# Altium schematic sheet TD4-ROM.SchDoc
size A2
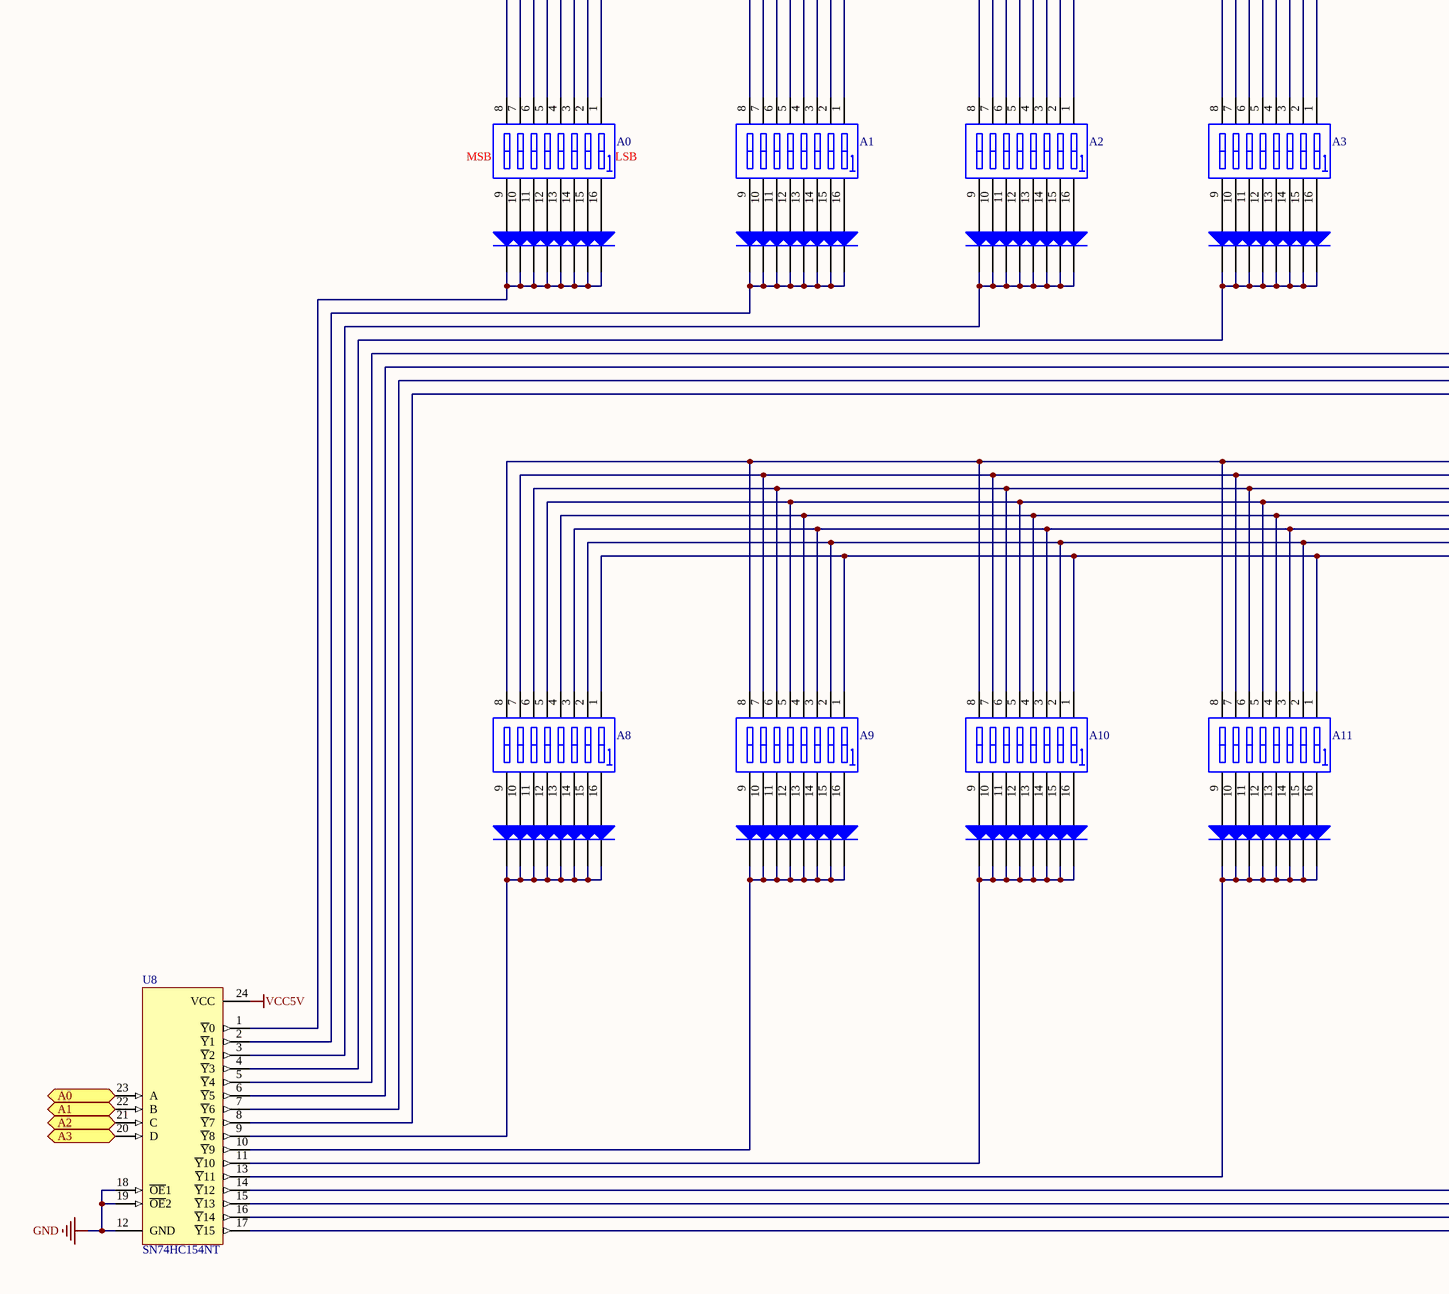
[diagram p0: TD4-ROM.SchDoc, left]
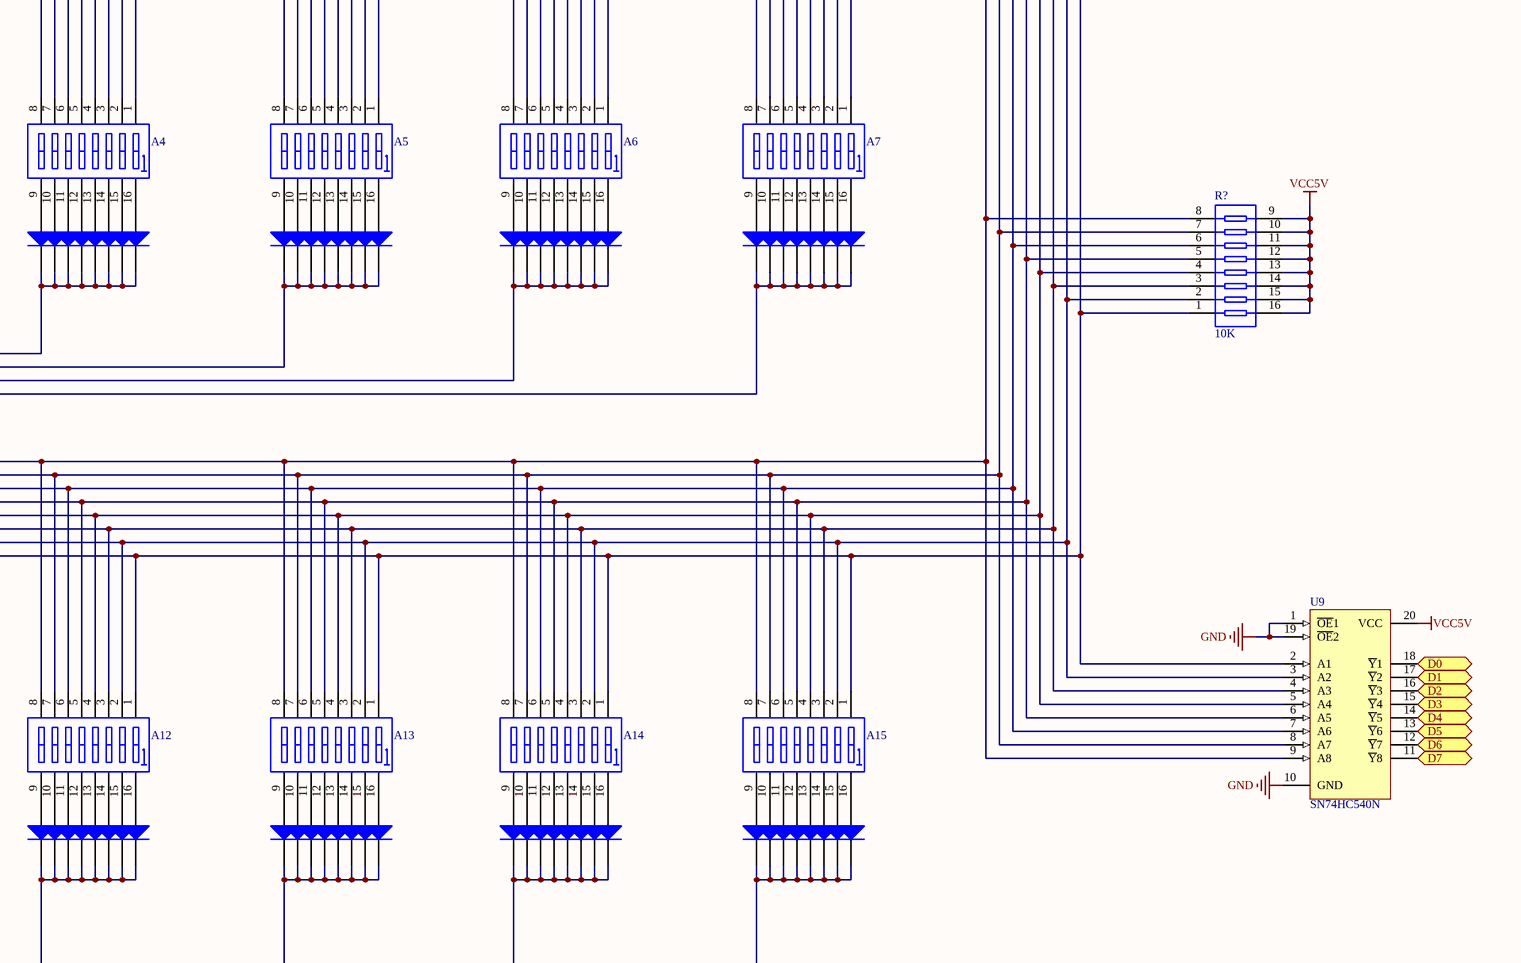
[diagram p1: TD4-ROM.SchDoc, right]

## Parts
D1  Diode 1N4148  [DO-35]  (value not drawn)
D2  Diode 1N4148  [DO-35]  (value not drawn)
D3  Diode 1N4148  [DO-35]  (value not drawn)
D4  Diode 1N4148  [DO-35]  (value not drawn)
D5  Diode 1N4148  [DO-35]  (value not drawn)
D6  Diode 1N4148  [DO-35]  (value not drawn)
D7  Diode 1N4148  [DO-35]  (value not drawn)
D8  Diode 1N4148  [DO-35]  (value not drawn)
D9  Diode 1N4148  [DO-35]  (value not drawn)
D10  Diode 1N4148  [DO-35]  (value not drawn)
D11  Diode 1N4148  [DO-35]  (value not drawn)
D12  Diode 1N4148  [DO-35]  (value not drawn)
D13  Diode 1N4148  [DO-35]  (value not drawn)
D14  Diode 1N4148  [DO-35]  (value not drawn)
D15  Diode 1N4148  [DO-35]  (value not drawn)
D16  Diode 1N4148  [DO-35]  (value not drawn)
D17  Diode 1N4148  [DO-35]  (value not drawn)
D18  Diode 1N4148  [DO-35]  (value not drawn)
D19  Diode 1N4148  [DO-35]  (value not drawn)
D20  Diode 1N4148  [DO-35]  (value not drawn)
D21  Diode 1N4148  [DO-35]  (value not drawn)
D22  Diode 1N4148  [DO-35]  (value not drawn)
D23  Diode 1N4148  [DO-35]  (value not drawn)
D24  Diode 1N4148  [DO-35]  (value not drawn)
D25  Diode 1N4148  [DO-35]  (value not drawn)
D26  Diode 1N4148  [DO-35]  (value not drawn)
D27  Diode 1N4148  [DO-35]  (value not drawn)
D28  Diode 1N4148  [DO-35]  (value not drawn)
D29  Diode 1N4148  [DO-35]  (value not drawn)
D30  Diode 1N4148  [DO-35]  (value not drawn)
D31  Diode 1N4148  [DO-35]  (value not drawn)
D32  Diode 1N4148  [DO-35]  (value not drawn)
D33  Diode 1N4148  [DO-35]  (value not drawn)
D34  Diode 1N4148  [DO-35]  (value not drawn)
D35  Diode 1N4148  [DO-35]  (value not drawn)
D36  Diode 1N4148  [DO-35]  (value not drawn)
D37  Diode 1N4148  [DO-35]  (value not drawn)
D38  Diode 1N4148  [DO-35]  (value not drawn)
D39  Diode 1N4148  [DO-35]  (value not drawn)
D40  Diode 1N4148  [DO-35]  (value not drawn)
D41  Diode 1N4148  [DO-35]  (value not drawn)
D42  Diode 1N4148  [DO-35]  (value not drawn)
D43  Diode 1N4148  [DO-35]  (value not drawn)
D44  Diode 1N4148  [DO-35]  (value not drawn)
D45  Diode 1N4148  [DO-35]  (value not drawn)
D46  Diode 1N4148  [DO-35]  (value not drawn)
D47  Diode 1N4148  [DO-35]  (value not drawn)
D48  Diode 1N4148  [DO-35]  (value not drawn)
D49  Diode 1N4148  [DO-35]  (value not drawn)
D50  Diode 1N4148  [DO-35]  (value not drawn)
D51  Diode 1N4148  [DO-35]  (value not drawn)
D52  Diode 1N4148  [DO-35]  (value not drawn)
D53  Diode 1N4148  [DO-35]  (value not drawn)
D54  Diode 1N4148  [DO-35]  (value not drawn)
D55  Diode 1N4148  [DO-35]  (value not drawn)
D56  Diode 1N4148  [DO-35]  (value not drawn)
D57  Diode 1N4148  [DO-35]  (value not drawn)
D58  Diode 1N4148  [DO-35]  (value not drawn)
D59  Diode 1N4148  [DO-35]  (value not drawn)
D60  Diode 1N4148  [DO-35]  (value not drawn)
D61  Diode 1N4148  [DO-35]  (value not drawn)
D62  Diode 1N4148  [DO-35]  (value not drawn)
D63  Diode 1N4148  [DO-35]  (value not drawn)
D64  Diode 1N4148  [DO-35]  (value not drawn)
D65  Diode 1N4148  [DO-35]  (value not drawn)
D66  Diode 1N4148  [DO-35]  (value not drawn)
D67  Diode 1N4148  [DO-35]  (value not drawn)
D68  Diode 1N4148  [DO-35]  (value not drawn)
D69  Diode 1N4148  [DO-35]  (value not drawn)
D70  Diode 1N4148  [DO-35]  (value not drawn)
D71  Diode 1N4148  [DO-35]  (value not drawn)
D72  Diode 1N4148  [DO-35]  (value not drawn)
D73  Diode 1N4148  [DO-35]  (value not drawn)
D74  Diode 1N4148  [DO-35]  (value not drawn)
D75  Diode 1N4148  [DO-35]  (value not drawn)
D76  Diode 1N4148  [DO-35]  (value not drawn)
D77  Diode 1N4148  [DO-35]  (value not drawn)
D78  Diode 1N4148  [DO-35]  (value not drawn)
D79  Diode 1N4148  [DO-35]  (value not drawn)
D80  Diode 1N4148  [DO-35]  (value not drawn)
D81  Diode 1N4148  [DO-35]  (value not drawn)
D82  Diode 1N4148  [DO-35]  (value not drawn)
D83  Diode 1N4148  [DO-35]  (value not drawn)
D84  Diode 1N4148  [DO-35]  (value not drawn)
D85  Diode 1N4148  [DO-35]  (value not drawn)
D86  Diode 1N4148  [DO-35]  (value not drawn)
D87  Diode 1N4148  [DO-35]  (value not drawn)
D88  Diode 1N4148  [DO-35]  (value not drawn)
D89  Diode 1N4148  [DO-35]  (value not drawn)
D90  Diode 1N4148  [DO-35]  (value not drawn)
D91  Diode 1N4148  [DO-35]  (value not drawn)
D92  Diode 1N4148  [DO-35]  (value not drawn)
D93  Diode 1N4148  [DO-35]  (value not drawn)
D94  Diode 1N4148  [DO-35]  (value not drawn)
D95  Diode 1N4148  [DO-35]  (value not drawn)
D96  Diode 1N4148  [DO-35]  (value not drawn)
D97  Diode 1N4148  [DO-35]  (value not drawn)
D98  Diode 1N4148  [DO-35]  (value not drawn)
D99  Diode 1N4148  [DO-35]  (value not drawn)
D100  Diode 1N4148  [DO-35]  (value not drawn)
D101  Diode 1N4148  [DO-35]  (value not drawn)
D102  Diode 1N4148  [DO-35]  (value not drawn)
D103  Diode 1N4148  [DO-35]  (value not drawn)
D104  Diode 1N4148  [DO-35]  (value not drawn)
D105  Diode 1N4148  [DO-35]  (value not drawn)
D106  Diode 1N4148  [DO-35]  (value not drawn)
D107  Diode 1N4148  [DO-35]  (value not drawn)
D108  Diode 1N4148  [DO-35]  (value not drawn)
D109  Diode 1N4148  [DO-35]  (value not drawn)
D110  Diode 1N4148  [DO-35]  (value not drawn)
D111  Diode 1N4148  [DO-35]  (value not drawn)
D112  Diode 1N4148  [DO-35]  (value not drawn)
D113  Diode 1N4148  [DO-35]  (value not drawn)
D114  Diode 1N4148  [DO-35]  (value not drawn)
D115  Diode 1N4148  [DO-35]  (value not drawn)
D116  Diode 1N4148  [DO-35]  (value not drawn)
D117  Diode 1N4148  [DO-35]  (value not drawn)
D118  Diode 1N4148  [DO-35]  (value not drawn)
D119  Diode 1N4148  [DO-35]  (value not drawn)
D120  Diode 1N4148  [DO-35]  (value not drawn)
D121  Diode 1N4148  [DO-35]  (value not drawn)
D122  Diode 1N4148  [DO-35]  (value not drawn)
D123  Diode 1N4148  [DO-35]  (value not drawn)
D124  Diode 1N4148  [DO-35]  (value not drawn)
D125  Diode 1N4148  [DO-35]  (value not drawn)
D126  Diode 1N4148  [DO-35]  (value not drawn)
D127  Diode 1N4148  [DO-35]  (value not drawn)
D128  Diode 1N4148  [DO-35]  (value not drawn)
R?  value 10K  [SSOP16_N]  (hidden comment: Res Pack4)
S1  A0  [DIP_SW_8WAY_SMD]
S2  A1  [DIP_SW_8WAY_SMD]
S3  A2  [DIP_SW_8WAY_SMD]
S4  A3  [DIP_SW_8WAY_SMD]
S5  A4  [DIP_SW_8WAY_SMD]
S6  A5  [DIP_SW_8WAY_SMD]
S7  A6  [DIP_SW_8WAY_SMD]
S8  A7  [DIP_SW_8WAY_SMD]
S9  A8  [DIP_SW_8WAY_SMD]
S10  A9  [DIP_SW_8WAY_SMD]
S11  A10  [DIP_SW_8WAY_SMD]
S12  A11  [DIP_SW_8WAY_SMD]
S13  A12  [DIP_SW_8WAY_SMD]
S14  A13  [DIP_SW_8WAY_SMD]
S15  A14  [DIP_SW_8WAY_SMD]
S16  A15  [DIP_SW_8WAY_SMD]
U8  SN74HC154NT  [NT024D]
U9  SN74HC540N  [N020]

## Ports
A0, A1, A2, A3, D0, D1, D2, D3, D4, D5, D6, D7

## Nets
GND: U8.12(GND) U8.18(~{OE}1) U8.19(~{OE}2) U9.1(~{OE}1) U9.10(GND) U9.19(~{OE}2)
VCC5V: R?.9 R?.10 R?.11 R?.12 R?.13 R?.14 R?.15 R?.16 U8.24(VCC) U9.20(VCC)
A0: U8.23(A) ; port A0
A1: U8.22(B) ; port A1
A2: U8.21(C) ; port A2
A3: U8.20(D) ; port A3
D0: U9.18(~{Y}1) ; port D0
D1: U9.17(~{Y}2) ; port D1
D2: U9.16(~{Y}3) ; port D2
D3: U9.15(~{Y}4) ; port D3
D4: U9.14(~{Y}5) ; port D4
D5: U9.13(~{Y}6) ; port D5
D6: U9.12(~{Y}7) ; port D6
D7: U9.11(~{Y}8) ; port D7
NetD1_1: D1.1(A) S1.9(B8)
NetD1_2: D1.2(K) D2.2(K) D3.2(K) D4.2(K) D5.2(K) D6.2(K) D7.2(K) D8.2(K) U8.1(~{Y}0)
NetD2_1: D2.1(A) S1.10(B7)
NetD3_1: D3.1(A) S1.11(B6)
NetD4_1: D4.1(A) S1.12(B5)
NetD5_1: D5.1(A) S1.13(B4)
NetD6_1: D6.1(A) S1.14(B3)
NetD7_1: D7.1(A) S1.15(B2)
NetD8_1: D8.1(A) S1.16(B1)
NetD9_1: D9.1(A) S2.9(B8)
NetD9_2: D9.2(K) D10.2(K) D11.2(K) D12.2(K) D13.2(K) D14.2(K) D15.2(K) D16.2(K) U8.2(~{Y}1)
NetD10_1: D10.1(A) S2.10(B7)
NetD11_1: D11.1(A) S2.11(B6)
NetD12_1: D12.1(A) S2.12(B5)
NetD13_1: D13.1(A) S2.13(B4)
NetD14_1: D14.1(A) S2.14(B3)
NetD15_1: D15.1(A) S2.15(B2)
NetD16_1: D16.1(A) S2.16(B1)
NetD17_1: D17.1(A) S3.9(B8)
NetD17_2: D17.2(K) D18.2(K) D19.2(K) D20.2(K) D21.2(K) D22.2(K) D23.2(K) D24.2(K) U8.3(~{Y}2)
NetD18_1: D18.1(A) S3.10(B7)
NetD19_1: D19.1(A) S3.11(B6)
NetD20_1: D20.1(A) S3.12(B5)
NetD21_1: D21.1(A) S3.13(B4)
NetD22_1: D22.1(A) S3.14(B3)
NetD23_1: D23.1(A) S3.15(B2)
NetD24_1: D24.1(A) S3.16(B1)
NetD25_1: D25.1(A) S4.9(B8)
NetD25_2: D25.2(K) D26.2(K) D27.2(K) D28.2(K) D29.2(K) D30.2(K) D31.2(K) D32.2(K) U8.4(~{Y}3)
NetD26_1: D26.1(A) S4.10(B7)
NetD27_1: D27.1(A) S4.11(B6)
NetD28_1: D28.1(A) S4.12(B5)
NetD29_1: D29.1(A) S4.13(B4)
NetD30_1: D30.1(A) S4.14(B3)
NetD31_1: D31.1(A) S4.15(B2)
NetD32_1: D32.1(A) S4.16(B1)
NetD33_1: D33.1(A) S5.9(B8)
NetD33_2: D33.2(K) D34.2(K) D35.2(K) D36.2(K) D37.2(K) D38.2(K) D39.2(K) D40.2(K) U8.5(~{Y}4)
NetD34_1: D34.1(A) S5.10(B7)
NetD35_1: D35.1(A) S5.11(B6)
NetD36_1: D36.1(A) S5.12(B5)
NetD37_1: D37.1(A) S5.13(B4)
NetD38_1: D38.1(A) S5.14(B3)
NetD39_1: D39.1(A) S5.15(B2)
NetD40_1: D40.1(A) S5.16(B1)
NetD41_1: D41.1(A) S6.9(B8)
NetD41_2: D41.2(K) D42.2(K) D43.2(K) D44.2(K) D45.2(K) D46.2(K) D47.2(K) D48.2(K) U8.6(~{Y}5)
NetD42_1: D42.1(A) S6.10(B7)
NetD43_1: D43.1(A) S6.11(B6)
NetD44_1: D44.1(A) S6.12(B5)
NetD45_1: D45.1(A) S6.13(B4)
NetD46_1: D46.1(A) S6.14(B3)
NetD47_1: D47.1(A) S6.15(B2)
NetD48_1: D48.1(A) S6.16(B1)
NetD49_1: D49.1(A) S7.9(B8)
NetD49_2: D49.2(K) D50.2(K) D51.2(K) D52.2(K) D53.2(K) D54.2(K) D55.2(K) D56.2(K) U8.7(~{Y}6)
NetD50_1: D50.1(A) S7.10(B7)
NetD51_1: D51.1(A) S7.11(B6)
NetD52_1: D52.1(A) S7.12(B5)
NetD53_1: D53.1(A) S7.13(B4)
NetD54_1: D54.1(A) S7.14(B3)
NetD55_1: D55.1(A) S7.15(B2)
NetD56_1: D56.1(A) S7.16(B1)
NetD57_1: D57.1(A) S8.9(B8)
NetD57_2: D57.2(K) D58.2(K) D59.2(K) D60.2(K) D61.2(K) D62.2(K) D63.2(K) D64.2(K) U8.8(~{Y}7)
NetD58_1: D58.1(A) S8.10(B7)
NetD59_1: D59.1(A) S8.11(B6)
NetD60_1: D60.1(A) S8.12(B5)
NetD61_1: D61.1(A) S8.13(B4)
NetD62_1: D62.1(A) S8.14(B3)
NetD63_1: D63.1(A) S8.15(B2)
NetD64_1: D64.1(A) S8.16(B1)
NetD65_1: D65.1(A) S9.9(B8)
NetD65_2: D65.2(K) D66.2(K) D67.2(K) D68.2(K) D69.2(K) D70.2(K) D71.2(K) D72.2(K) U8.9(~{Y}8)
NetD66_1: D66.1(A) S9.10(B7)
NetD67_1: D67.1(A) S9.11(B6)
NetD68_1: D68.1(A) S9.12(B5)
NetD69_1: D69.1(A) S9.13(B4)
NetD70_1: D70.1(A) S9.14(B3)
NetD71_1: D71.1(A) S9.15(B2)
NetD72_1: D72.1(A) S9.16(B1)
NetD73_1: D73.1(A) S10.9(B8)
NetD73_2: D73.2(K) D74.2(K) D75.2(K) D76.2(K) D77.2(K) D78.2(K) D79.2(K) D80.2(K) U8.10(~{Y}9)
NetD74_1: D74.1(A) S10.10(B7)
NetD75_1: D75.1(A) S10.11(B6)
NetD76_1: D76.1(A) S10.12(B5)
NetD77_1: D77.1(A) S10.13(B4)
NetD78_1: D78.1(A) S10.14(B3)
NetD79_1: D79.1(A) S10.15(B2)
NetD80_1: D80.1(A) S10.16(B1)
NetD81_1: D81.1(A) S11.9(B8)
NetD81_2: D81.2(K) D82.2(K) D83.2(K) D84.2(K) D85.2(K) D86.2(K) D87.2(K) D88.2(K) U8.11(~{Y}10)
NetD82_1: D82.1(A) S11.10(B7)
NetD83_1: D83.1(A) S11.11(B6)
NetD84_1: D84.1(A) S11.12(B5)
NetD85_1: D85.1(A) S11.13(B4)
NetD86_1: D86.1(A) S11.14(B3)
NetD87_1: D87.1(A) S11.15(B2)
NetD88_1: D88.1(A) S11.16(B1)
NetD89_1: D89.1(A) S12.9(B8)
NetD89_2: D89.2(K) D90.2(K) D91.2(K) D92.2(K) D93.2(K) D94.2(K) D95.2(K) D96.2(K) U8.13(~{Y}11)
NetD90_1: D90.1(A) S12.10(B7)
NetD91_1: D91.1(A) S12.11(B6)
NetD92_1: D92.1(A) S12.12(B5)
NetD93_1: D93.1(A) S12.13(B4)
NetD94_1: D94.1(A) S12.14(B3)
NetD95_1: D95.1(A) S12.15(B2)
NetD96_1: D96.1(A) S12.16(B1)
NetD97_1: D97.1(A) S13.9(B8)
NetD97_2: D97.2(K) D98.2(K) D99.2(K) D100.2(K) D101.2(K) D102.2(K) D103.2(K) D104.2(K) U8.14(~{Y}12)
NetD98_1: D98.1(A) S13.10(B7)
NetD99_1: D99.1(A) S13.11(B6)
NetD100_1: D100.1(A) S13.12(B5)
NetD101_1: D101.1(A) S13.13(B4)
NetD102_1: D102.1(A) S13.14(B3)
NetD103_1: D103.1(A) S13.15(B2)
NetD104_1: D104.1(A) S13.16(B1)
NetD105_1: D105.1(A) S14.9(B8)
NetD105_2: D105.2(K) D106.2(K) D107.2(K) D108.2(K) D109.2(K) D110.2(K) D111.2(K) D112.2(K) U8.15(~{Y}13)
NetD106_1: D106.1(A) S14.10(B7)
NetD107_1: D107.1(A) S14.11(B6)
NetD108_1: D108.1(A) S14.12(B5)
NetD109_1: D109.1(A) S14.13(B4)
NetD110_1: D110.1(A) S14.14(B3)
NetD111_1: D111.1(A) S14.15(B2)
NetD112_1: D112.1(A) S14.16(B1)
NetD113_1: D113.1(A) S15.9(B8)
NetD113_2: D113.2(K) D114.2(K) D115.2(K) D116.2(K) D117.2(K) D118.2(K) D119.2(K) D120.2(K) U8.16(~{Y}14)
NetD114_1: D114.1(A) S15.10(B7)
NetD115_1: D115.1(A) S15.11(B6)
NetD116_1: D116.1(A) S15.12(B5)
NetD117_1: D117.1(A) S15.13(B4)
NetD118_1: D118.1(A) S15.14(B3)
NetD119_1: D119.1(A) S15.15(B2)
NetD120_1: D120.1(A) S15.16(B1)
NetD121_1: D121.1(A) S16.9(B8)
NetD121_2: D121.2(K) D122.2(K) D123.2(K) D124.2(K) D125.2(K) D126.2(K) D127.2(K) D128.2(K) U8.17(~{Y}15)
NetD122_1: D122.1(A) S16.10(B7)
NetD123_1: D123.1(A) S16.11(B6)
NetD124_1: D124.1(A) S16.12(B5)
NetD125_1: D125.1(A) S16.13(B4)
NetD126_1: D126.1(A) S16.14(B3)
NetD127_1: D127.1(A) S16.15(B2)
NetD128_1: D128.1(A) S16.16(B1)
NetR?_1: R?.1 S1.1(A1) S2.1(A1) S3.1(A1) S4.1(A1) S5.1(A1) S6.1(A1) S7.1(A1) S8.1(A1) S9.1(A1) S10.1(A1) S11.1(A1) S12.1(A1) S13.1(A1) S14.1(A1) S15.1(A1) S16.1(A1) U9.2(A1)
NetR?_2: R?.2 S1.2(A2) S2.2(A2) S3.2(A2) S4.2(A2) S5.2(A2) S6.2(A2) S7.2(A2) S8.2(A2) S9.2(A2) S10.2(A2) S11.2(A2) S12.2(A2) S13.2(A2) S14.2(A2) S15.2(A2) S16.2(A2) U9.3(A2)
NetR?_3: R?.3 S1.3(A3) S2.3(A3) S3.3(A3) S4.3(A3) S5.3(A3) S6.3(A3) S7.3(A3) S8.3(A3) S9.3(A3) S10.3(A3) S11.3(A3) S12.3(A3) S13.3(A3) S14.3(A3) S15.3(A3) S16.3(A3) U9.4(A3)
NetR?_4: R?.4 S1.4(A4) S2.4(A4) S3.4(A4) S4.4(A4) S5.4(A4) S6.4(A4) S7.4(A4) S8.4(A4) S9.4(A4) S10.4(A4) S11.4(A4) S12.4(A4) S13.4(A4) S14.4(A4) S15.4(A4) S16.4(A4) U9.5(A4)
NetR?_5: R?.5 S1.5(A5) S2.5(A5) S3.5(A5) S4.5(A5) S5.5(A5) S6.5(A5) S7.5(A5) S8.5(A5) S9.5(A5) S10.5(A5) S11.5(A5) S12.5(A5) S13.5(A5) S14.5(A5) S15.5(A5) S16.5(A5) U9.6(A5)
NetR?_6: R?.6 S1.6(A6) S2.6(A6) S3.6(A6) S4.6(A6) S5.6(A6) S6.6(A6) S7.6(A6) S8.6(A6) S9.6(A6) S10.6(A6) S11.6(A6) S12.6(A6) S13.6(A6) S14.6(A6) S15.6(A6) S16.6(A6) U9.7(A6)
NetR?_7: R?.7 S1.7(A7) S2.7(A7) S3.7(A7) S4.7(A7) S5.7(A7) S6.7(A7) S7.7(A7) S8.7(A7) S9.7(A7) S10.7(A7) S11.7(A7) S12.7(A7) S13.7(A7) S14.7(A7) S15.7(A7) S16.7(A7) U9.8(A7)
NetR?_8: R?.8 S1.8(A8) S2.8(A8) S3.8(A8) S4.8(A8) S5.8(A8) S6.8(A8) S7.8(A8) S8.8(A8) S9.8(A8) S10.8(A8) S11.8(A8) S12.8(A8) S13.8(A8) S14.8(A8) S15.8(A8) S16.8(A8) U9.9(A8)

## Notes on the sheet
- (near S1) MSB
- (near S1) LSB

## Library data of the parts
D1-D128 = Diode 1N4148: High Conductance Fast Diode; Published: 8-Jun-2000; LatestRevisionDate: 17-Jul-2002; LatestRevisionNote: Re-released for DXP Platform.; DatasheetVersion: 1997; PackageReference: DO-35; Publisher: Altium Limited; PackageDescription: Diode, Axial; Body 3.8 x 1.9 mm (LxDia. max), Lead Dia. 0.53 mm (max); Code_JEDEC: DO-204-AH; ComponentLink1Description: Manufacturer Link; ComponentLink1URL: http://www.fairchildsemi.com/; ComponentLink2Description: Datasheet; ComponentLink2URL: http://www.fairchildsemi.com/ds/1N%2F1N4148.pdf
R? = Res Pack4: Isolated Resistor Network; Published: 24-Mar-1999; LatestRevisionDate: 29-May-2009; LatestRevisionNote: IPC-7351 Footprint Added.; PackageVersion: Oct-2003; PackageReference: SSOP16; Publisher: Altium Limited; PackageDescription: 16-Pin Plastic Small Outline Package 0.65 mm Pitch; Code_JEDEC: MO-150-AC; Code_IPC: SOP65P780-16
S1-S16 = SW DIP-8: DIP Switch, 8 Position, SPST; Published: 24-Mar-1999; LatestRevisionDate: 17-Jul-2002; LatestRevisionNote: Re-released for DXP Platform.; PackageReference: DIP_SW_8WAY_SMD; Publisher: Altium Limited; PackageDescription: DIP Switch; 16 Leads
U8 = SN74HC154NT: 4-Line to 16-Line Decoder / Demultiplexer; ComponentAvailability: Obsolete; Published: 8-Jun-2000; LatestRevisionDate: 04-Mar-2005; LatestRevisionNote: Stylized 3D Model Added.; DatasheetVersion: Sep-1987; PackageVersion: Oct-1994; PackageReference: NT024D; Publisher: Altium Limited; PackageDescription: DIP; 24 Leads; Row Spacing 7.62 mm; Pitch 2.54 mm; Code_JEDEC: MS-001-AF; ComponentLink1Description: Manufacturer Link; ComponentLink1URL: http://www.ti.com/; ComponentLink2Description: Discontinuation Notice; ComponentLink2URL: http://focus.ti.com/docs/prod/folders/print/sn74hc154.html
U9 = SN74HC540N: Octal Buffer and Line Driver with 3-State Outputs; Published: 8-Jun-2000; LatestRevisionDate: 06-Jun-2005; LatestRevisionNote: Stylized 3D Model Added.; DatasheetVersion: May-1997; PackageVersion: Oct-1995; PackageReference: N020; Publisher: Altium Limited; PackageDescription: DIP; 20 Leads; Row Spacing 7.62 mm; Pitch 2.54 mm; ComponentLink1Description: Manufacturer Link; ComponentLink1URL: http://www.ti.com/; ComponentLink2Description: Datasheet; ComponentLink2URL: http://www-s.ti.com/sc/ds/sn74hc540.pdf